# EAGLE design WT32SC01-POE v2 (EAGLE 9.6.2)
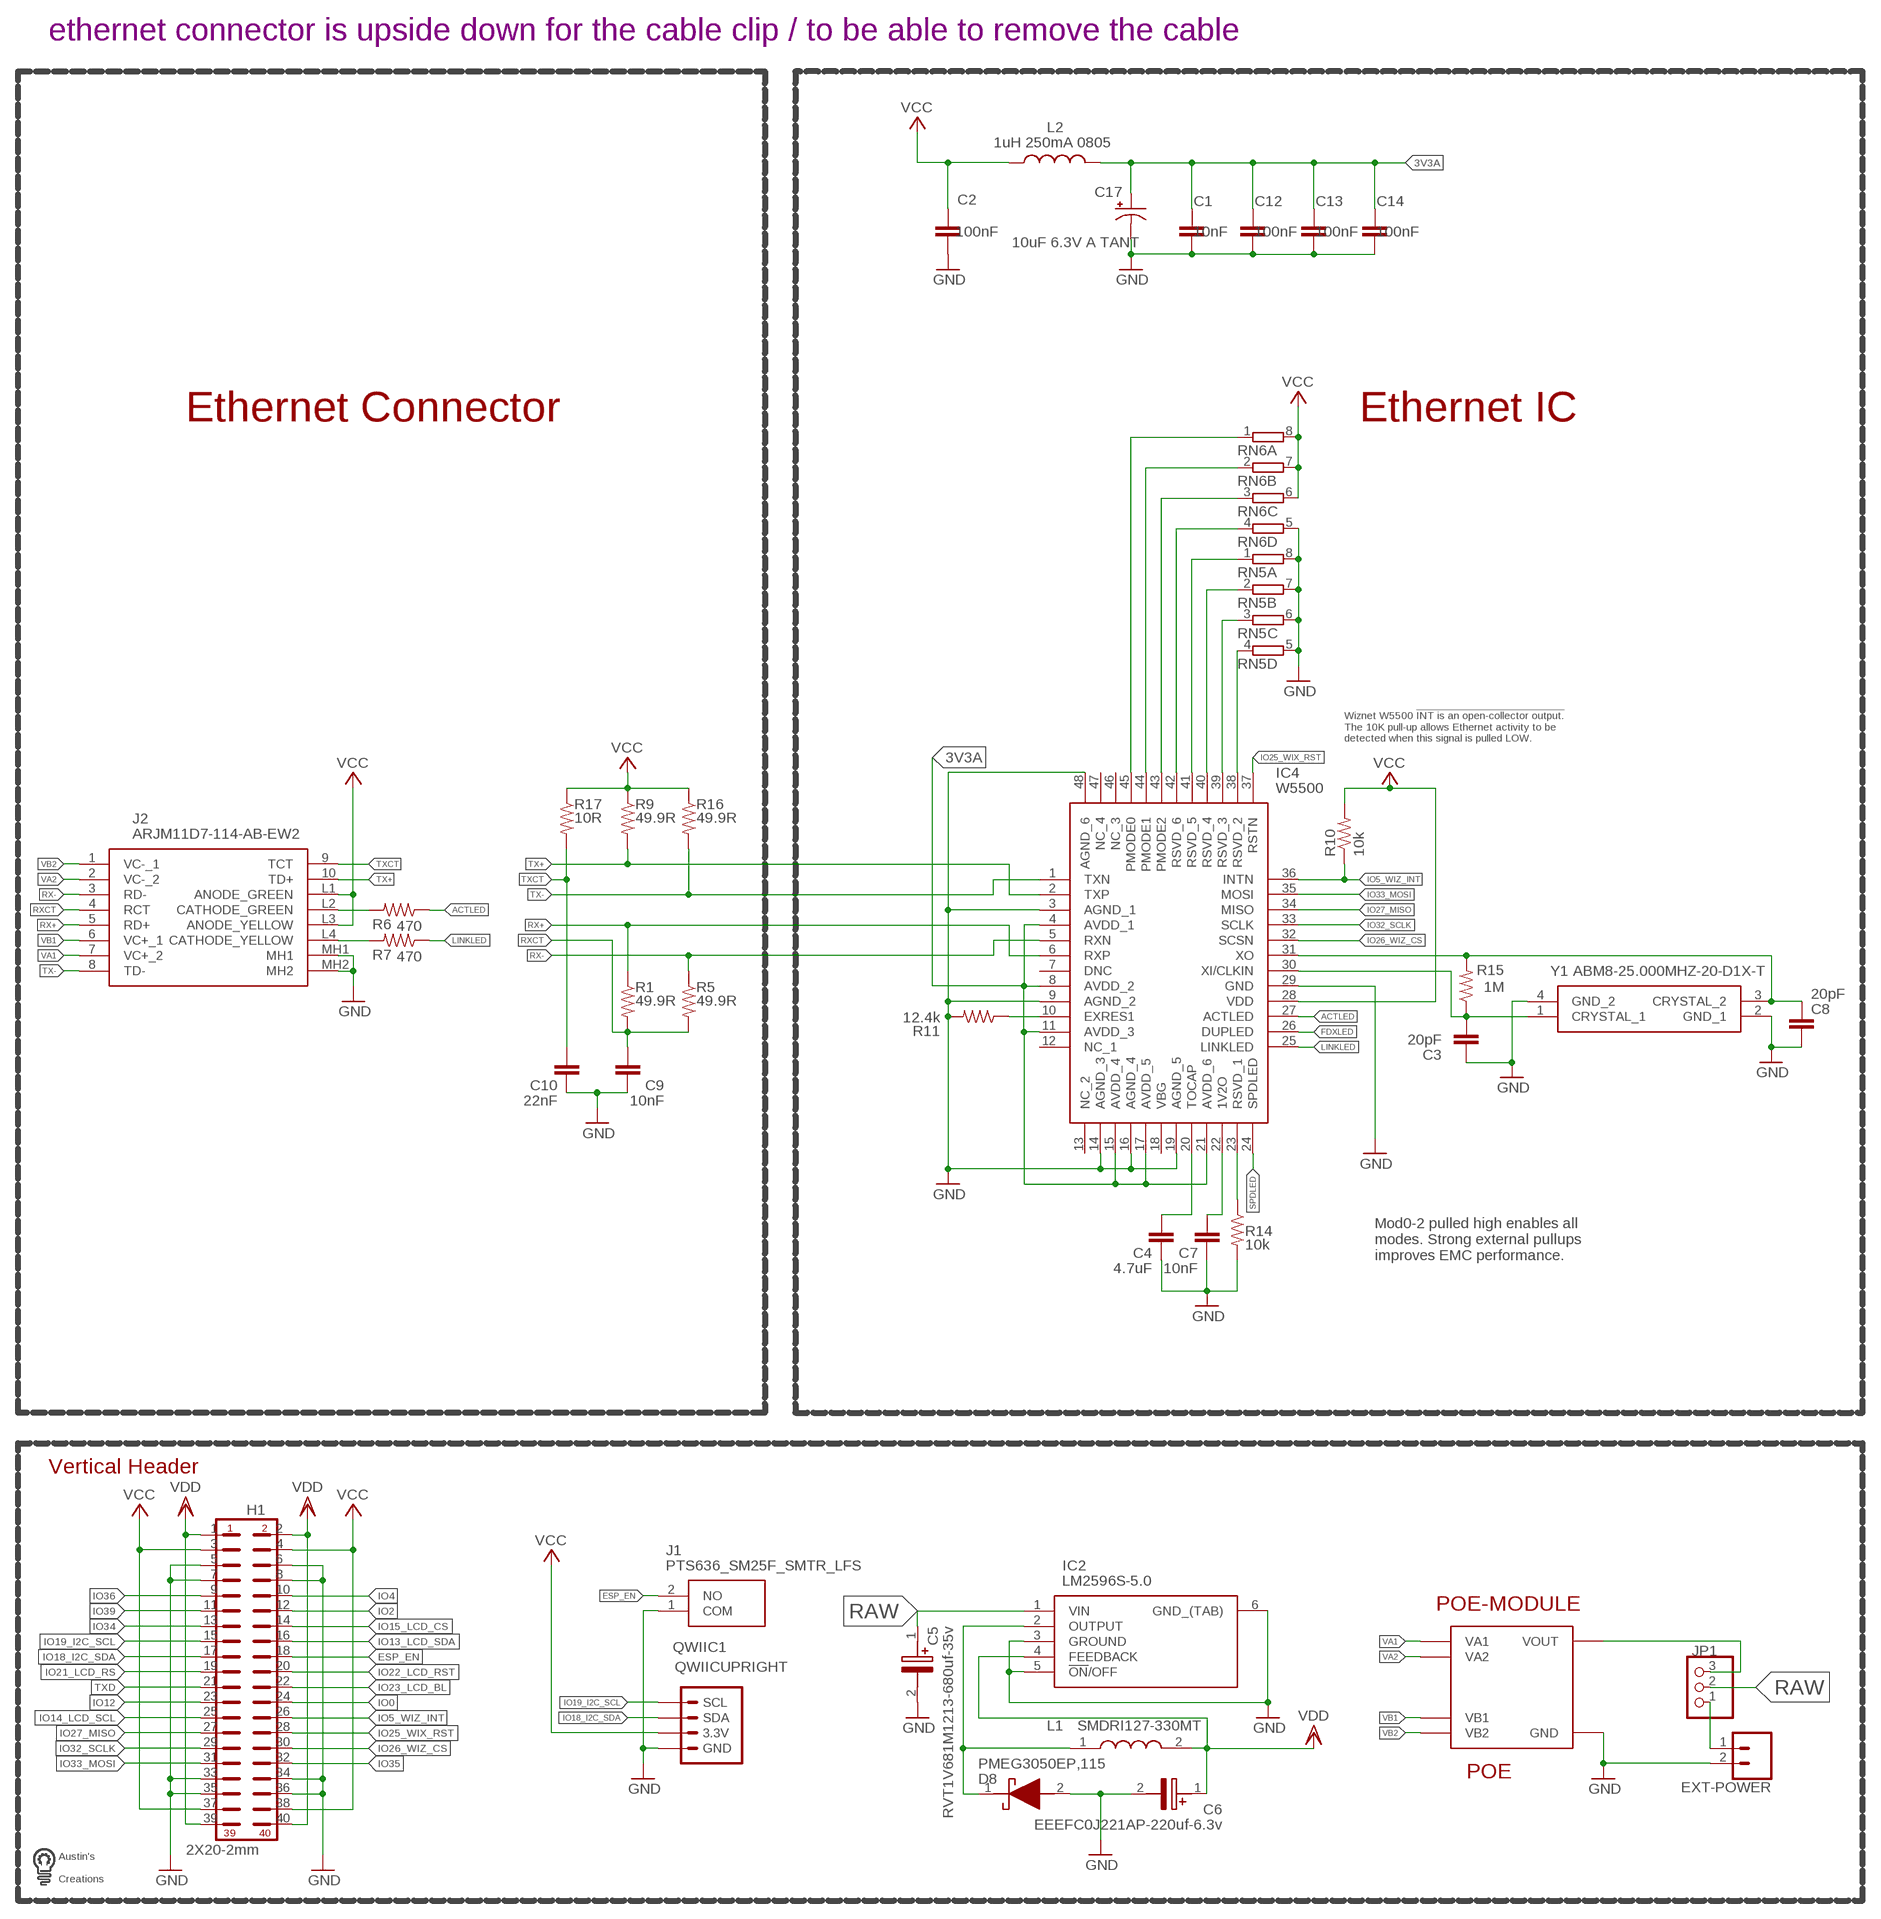
[diagram p0: schematic, sheet 1]

## Parts
C1  10nF  C-EUC0603  [C0603]
C2  100nF  C-EUC0603  [C0603]
C3  20pF  C-EUC0603  [C0603]
C4  4.7uF  C-EUC0603  [C0603]
C5  RVT1V681M1213-680uf-35v  EEE-HD1V681AQ  [CAPAE1350X1400N]
C6  EEEFC0J221AP-220uf-6.3v  EEEFC0J221AP  [CAPAE830X650N]
C7  10nF  C-EUC0603  [C0603]
C8  20pF  C-EUC0603  [C0603]
C9  10nF  C-EUC0603  [C0603]
C10  22nF  C-EUC0603  [C0603]
C12  100nF  C-EUC0603  [C0603]
C13  100nF  C-EUC0603  [C0603]
C14  100nF  C-EUC0603  [C0603]
C17  10uF 6.3V A TANT  CPOL-USA/3216-18W  [A/3216-18W]
D8  PMEG3050EP,115  [PMEG3050EP115]
EXT-POWER  JL301-50002U02  2PINBLOCK  [SCREWTERMINAL-5MM-2]
H1  2X20-2mm  M02X20-2.00-P-BELOW  [2X20-2.00-P-BELOW]
IC2  LM2596S-5.0  LM2596S-3.3_NOPB  [TO170P1435X465-6N]
IC4  W5500  [QFP50P900X900X160-48N]
J1  PTS636_SM25F_SMTR_LFS  [PTS636SM25FSMTRLFS]
J2  ARJM11D7-114-AB-EW2  [ARJM11D7114ABEW2]
JP1  PINHD-1X3  [1X03]
L1  SMDRI127-330MT  CDRH127_LDNP-330MC  [INDPM120120X800N]
L2  1uH 250mA 0805  L-USL2012C  [L2012C]
POE-MODULE  POE  [DP1435]
QWIIC1  QWIICUPRIGHT  [BM04B-SRSS-TB]
R1  49.9R  R-US_R0603  [R0603]
R5  49.9R  R-US_R0603  [R0603]
R6  470  R-US_R0603  [R0603]
R7  470  R-US_R0603  [R0603]
R9  49.9R  R-US_R0603  [R0603]
R10  10k  R-US_R0603  [R0603]
R11  12.4k  R-US_R0603  [R0603]
R14  10k  R-US_R0603  [R0603]
R15  1M  R-US_R0603  [R0603]
R16  49.9R  R-US_R0603  [R0603]
R17  10R  R-US_R0603  [R0603]
RN5  4R-N0603-ARC  [0603-ARC]
RN6  4R-N0603-ARC  [0603-ARC]
U$1  LOGOMED  [LOGOMED]
Y1  ABM8-25.000MHZ-20-D1X-T  [ABM825000MHZ10B1UT]

## Nets
3V3A: C1.1 C12.1 C13.1 C14.1 C17.+ IC4.4(AVDD_1) IC4.8(AVDD_2) IC4.11(AVDD_3) IC4.15(AVDD_4) IC4.17(AVDD_5) IC4.21(AVDD_6) L2.2
ACTLED: IC4.27(ACTLED) R6.1
ESP_EN: H1.18 J1.2(NO)
FDXLED: IC4.26(DUPLED)
GND: C1.2 C2.2 C3.1 C4.1 C5.2(-) C6.2(-) C7.1 C8.1 C9.1 C10.1 C12.2 C13.2 C14.2 C17.- D8.2(A) EXT-POWER.2 H1.5 H1.6 H1.7 H1.8 H1.33 H1.34 H1.35 H1.36 IC2.3(GROUND) IC2.5(!ON!/OFF) IC2.6(GND_(TAB)) IC4.3(AGND_1) IC4.9(AGND_2) IC4.14(AGND_3) IC4.16(AGND_4) IC4.19(AGND_5) IC4.29(GND) IC4.48(AGND_6) J1.1(COM) J2.MH1 J2.MH2 POE-MODULE.GND QWIIC1.1(GND) R11.2 R14.2 RN5.5 RN5.6 RN5.7 RN5.8 RN6.5 Y1.2(GND_1) Y1.4(GND_2)
IO0: H1.24
IO2: H1.12
IO4: H1.10
IO5_WIZ_INT: H1.26 IC4.36(INTN) R10.1
IO12: H1.23
IO13_LCD_SDA: H1.16
IO14_LCD_SCL: H1.25
IO15_LCD_CS: H1.14
IO18_I2C_SDA: H1.17 QWIIC1.3(SDA)
IO19_I2C_SCL: H1.15 QWIIC1.4(SCL)
IO21_LCD_RS: H1.19
IO22_LCD_RST: H1.20
IO23_LCD_BL: H1.22
IO25_WIX_RST: H1.28 IC4.37(RSTN)
IO26_WIZ_CS: H1.30 IC4.32(SCSN)
IO27_MISO: H1.27 IC4.34(MISO)
IO32_SCLK: H1.29 IC4.33(SCLK)
IO33_MOSI: H1.31 IC4.35(MOSI)
IO34: H1.13
IO35: H1.32
IO36: H1.9
IO39: H1.11
LINKLED: IC4.25(LINKLED) R7.1
N$1: EXT-POWER.1 JP1.1
N$2: IC4.10(EXRES1) R11.1
N$3: IC4.23(RSVD_1) R14.1
N$4: IC4.38(RSVD_2) RN5.4
N$5: IC4.39(RSVD_3) RN5.3
N$6: IC4.40(RSVD_4) RN5.2
N$7: IC4.41(RSVD_5) RN5.1
N$9: IC4.42(RSVD_6) RN6.4
N$10: C8.2 IC4.31(XO) R15.2 Y1.3(CRYSTAL_2)
N$11: IC4.43(PMODE2) RN6.3
N$12: IC4.44(PMODE1) RN6.2
N$13: IC4.45(PMODE0) RN6.1
N$16: C3.2 IC4.30(XI/CLKIN) R15.1 Y1.1(CRYSTAL_1)
N$17: JP1.3 POE-MODULE.VOUT
N$19: J2.L2(CATHODE_GREEN) R6.2
N$20: D8.1(K) IC2.2(OUTPUT) L1.1
N$21: J2.L4(CATHODE_YELLOW) R7.2
N$25: C7.2 IC4.22(1V2O)
N$26: C4.2 IC4.20(TOCAP)
RAW: C5.1(+) IC2.1(VIN) JP1.2
RX+: IC4.6(RXP) J2.5(RD+) R1.1
RX-: IC4.5(RXN) J2.3(RD-) R5.1
RXCT: C9.2 J2.4(RCT) R1.2 R5.2
SPDLED: IC4.24(SPDLED)
TX+: IC4.2(TXP) J2.10(TD+) R9.2
TX-: IC4.1(TXN) J2.8(TD-) R16.2
TXCT: C10.2 J2.9(TCT) R17.2
TXD: H1.21
VA1: J2.7(VC+_2) POE-MODULE.VA1
VA2: J2.2(VC-_2) POE-MODULE.VA2
VB1: J2.6(VC+_1) POE-MODULE.VB1
VB2: J2.1(VC-_1) POE-MODULE.VB2
VCC: C2.1 H1.3 H1.4 H1.37 H1.38 IC4.28(VDD) J2.L1(ANODE_GREEN) J2.L3(ANODE_YELLOW) L2.1 QWIIC1.2(3.3V) R9.1 R10.2 R16.1 R17.1 RN6.6 RN6.7 RN6.8
VDD: C6.1(+) H1.1 H1.2 H1.39 H1.40 IC2.4(FEEDBACK) L1.2
Unconnected: IC4.7(DNC) IC4.12(NC_1) IC4.13(NC_2) IC4.18(VBG) IC4.46(NC_3) IC4.47(NC_4)

## Notes on the sheet
- ethernet connector is upside down for the cable clip / to be able to remove the cable
- Ethernet Connector | Ethernet IC
- Wiznet W5500 !INT is an open-collector output.
  The 10K pull-up allows Ethernet activity to be
  detected when this signal is pulled LOW.
- Mod0-2 pulled high enables all
  modes. Strong external pullups
  improves EMC performance.
- Vertical Header

## Library data of the parts
C1 C2 C12-C14 = rcl:C-EU: CAPACITOR, European symbol; SPICEPREFIX: C
C3 C4 C7-C10 = resistor:C-EU: CAPACITOR, European symbol
C5 = SamacSys_Parts:EEE-HD1V681AQ: Aluminium Electrolytic Capacitors - SMD 35VDC 680uF 20% AEC-Q200 Source: Datasheet <https://industrial.panasonic.com/cdbs/www-data/pdf/RDE0000/ABA0000C1166.pdf>; DESCRIPTION: Aluminium Electrolytic Capacitors - SMD 35VDC 680uF 20% AEC-Q200; HEIGHT: 14mm; MANUFACTURER_NAME: Panasonic; MANUFACTURER_PART_NUMBER: EEE-HD1V681AQ; MOUSER_PART_NUMBER: 667-EEE-HD1V681AQ; MOUSER_PRICE-STOCK: https://www.mouser.co.uk/ProductDetail/Panasonic/EEE-HD1V681AQ?qs=w%2Fv1CP2dgqoW7i2Hoqi%252B9w%3D%3D
C6 = SamacSys_Parts:EEEFC0J221AP: PANASONIC - EEEFC0J221AP - SMD Aluminium Electrolytic Capacitor, Radial Can - SMD, 220 F, 6.3 V, EEEFC Series Source: Datasheet <https://industrial.panasonic.com/cdbs/www-data/pdf/RDE0000/ABA0000C1169.pdf>; DESCRIPTION: PANASONIC - EEEFC0J221AP - SMD Aluminium Electrolytic Capacitor, Radial Can - SMD, 220 F, 6.3 V, EEEFC Series; HEIGHT: 6.5mm; MANUFACTURER_NAME: Panasonic; MANUFACTURER_PART_NUMBER: EEEFC0J221AP
C17 = rcl:CPOL-US: POLARIZED CAPACITOR, American symbol; SPICEPREFIX: C
D8 = SamacSys_Parts:PMEG3050EP,115: NXP PMEG3050EP,115 SMT Schottky Diode, 30V 5A, 2-Pin SOD-128 Source: Datasheet <https://docs-emea.rs-online.com/webdocs/14cd/0900766b814cd012.pdf>; ARROW_PART_NUMBER: PMEG3050EP,115; ARROW_PRICE-STOCK: https://www.arrow.com/en/products/pmeg3050ep115/nexperia; DESCRIPTION: NXP PMEG3050EP,115 SMT Schottky Diode, 30V 5A, 2-Pin SOD-128; HEIGHT: 1mm; MANUFACTURER_NAME: Nexperia; MANUFACTURER_PART_NUMBER: PMEG3050EP,115; MOUSER_PART_NUMBER: 771-PMEG3050EP115; MOUSER_PRICE-STOCK: https://www.mouser.co.uk/ProductDetail/Nexperia/PMEG3050EP115?qs=GcY6OjH1zdmnjQ%2FhUT5aOA%3D%3D
EXT-POWER = custom parts:2PINBLOCK
H1 = SuperHouse-Connectors:M02X20: M40 header in 2x20 format
IC2 = SamacSys_Parts:LM2596S-3.3_NOPB: SIMPLE SWITCHER® 4.5V to 40V, 3A Low Component Count Step-Down Regulator Source: Datasheet <http://www.ti.com/lit/ds/symlink/lm2596.pdf>; DESCRIPTION: SIMPLE SWITCHER&#174; 4.5V to 40V, 3A Low Component Count Step-Down Regulator; HEIGHT: 4.65mm; MANUFACTURER_NAME: Texas Instruments; MANUFACTURER_PART_NUMBER: LM2596S-3.3/NOPB; MOUSER_PART_NUMBER: 926-LM2596S-3.3/NOPB; MOUSER_PRICE-STOCK: https://www.mouser.co.uk/ProductDetail/Texas-Instruments/LM2596S-33-NOPB?qs=X1J7HmVL2ZHsEwG9Q6doow%3D%3D
IC4 = SamacSys_Parts:W5500: Ethernet ICs 3in1 Enet Controller TCP/IP +MAC+PHY Source: Datasheet <http://wizwiki.net/wiki/lib/exe/fetch.php?media=products:w5500:w5500_ds_v106e_141230.pdf>; DESCRIPTION: Ethernet ICs 3in1 Enet Controller TCP/IP +MAC+PHY; HEIGHT: 1.6mm; MANUFACTURER_NAME: WIZnet Inc; MANUFACTURER_PART_NUMBER: W5500; MOUSER_PART_NUMBER: 950-W5500; MOUSER_PRICE-STOCK: https://www.mouser.co.uk/ProductDetail/WIZnet/W5500/?qs=2vh%252B45pPFtzthUpYPd4pqA%3D%3D
J1 = SamacSys_Parts:PTS636_SM25F_SMTR_LFS: Tactile Switches Tact 50mA 12VDC, 6.0x3.5, 2.5mm H, 180gf, F leads, No ground pin, White Actuator Source: Datasheet <https://ms.componentsearchengine.com/Datasheets/1/PTS636 SM25F SMTR LFS.pdf>; ARROW_PART_NUMBER: PTS636 SM25F SMTR LFS; ARROW_PRICE-STOCK: https://www.arrow.com/en/products/pts636-sm25f-smtr-lfs/ck; DESCRIPTION: Tactile Switches Tact 50mA 12VDC, 6.0x3.5, 2.5mm H, 180gf, F leads, No ground pin, White Actuator; HEIGHT: 2.7mm; MANUFACTURER_NAME: C & K COMPONENTS; MANUFACTURER_PART_NUMBER: PTS636 SM25F SMTR LFS; MOUSER_PART_NUMBER: 611-PTS636SM25FSMTRL; MOUSER_PRICE-STOCK: https://www.mouser.co.uk/ProductDetail/CK/PTS636-SM25F-SMTR-LFS?qs=vLWxofP3U2wcBTQSwfMFOw%3D%3D
J2 = custom parts:ARJM11D7-114-AB-EW2: Modular Connectors / Ethernet Connectors Source: Datasheet; DESCRIPTION: Modular Connectors / Ethernet Connectors; HEIGHT: 13.6mm; MANUFACTURER_NAME: ABRACON; MANUFACTURER_PART_NUMBER: ARJM11D7-114-AB-EW2; MOUSER_PART_NUMBER: 815-RJM11D7114ABEW2; MOUSER_PRICE-STOCK: https://www.mouser.co.uk/ProductDetail/ABRACON/ARJM11D7-114-AB-EW2?qs=YCa%2FAAYMW02ICsJcHu%252BNJg%3D%3D
JP1 = custom parts:PINHD-1X3: PIN HEADER
L1 = SamacSys_Parts:CDRH127_LDNP-330MC: Fixed Inductors 33uH 3.9A Source: Datasheet <https://products.sumida.com/products/pdf/CDRH127LD.pdf>; DESCRIPTION: Fixed Inductors 33uH 3.9A; HEIGHT: 8mm; MANUFACTURER_NAME: Sumida; MANUFACTURER_PART_NUMBER: CDRH127/LDNP-330MC; MOUSER_PART_NUMBER: 851-CDRH127LDNP330MC; MOUSER_PRICE-STOCK: https://www.mouser.co.uk/ProductDetail/Sumida/CDRH127-LDNP-330MC?qs=rZntyWl5IYHj3wgmnQ0WOg%3D%3D
L2 = rcl:L-US: INDUCTOR, American symbol; SPICEPREFIX: L
POE-MODULE = custom parts:POE; POEMODULE: DP1435
QWIIC1 = custom parts:QWIIC
R1 R5-R7 R9-R11 R14-R17 = resistor:R-US_: RESISTOR, American symbol
RN5 RN6 = custom parts:4R-N: Array Chip Resistor Source: RS Component / Phycomp; OC_FARNELL: unknown; OC_NEWARK: unknown
U$1 = custom parts:LOGOMED
Y1 = custom parts:ABM8-25.000MHZ-20-D1X-T: CRYSTAL 25.0000MHZ 20PF SMD Source: Datasheet <https://abracon.com/Resonators/abm8.pdf>; DESCRIPTION: CRYSTAL 25.0000MHZ 20PF SMD; HEIGHT: 0.8mm; MANUFACTURER_NAME: ABRACON; MANUFACTURER_PART_NUMBER: ABM8-25.000MHz-20-D1X-T; MOUSER_PART_NUMBER: 815-M825000MHZ20D1XT; MOUSER_PRICE-STOCK: https://www.mouser.co.uk/ProductDetail/ABRACON/ABM8-25000MHZ-20-D1X-T?qs=vLWxofP3U2wG9GR0CKrroQ%3D%3D

## Board
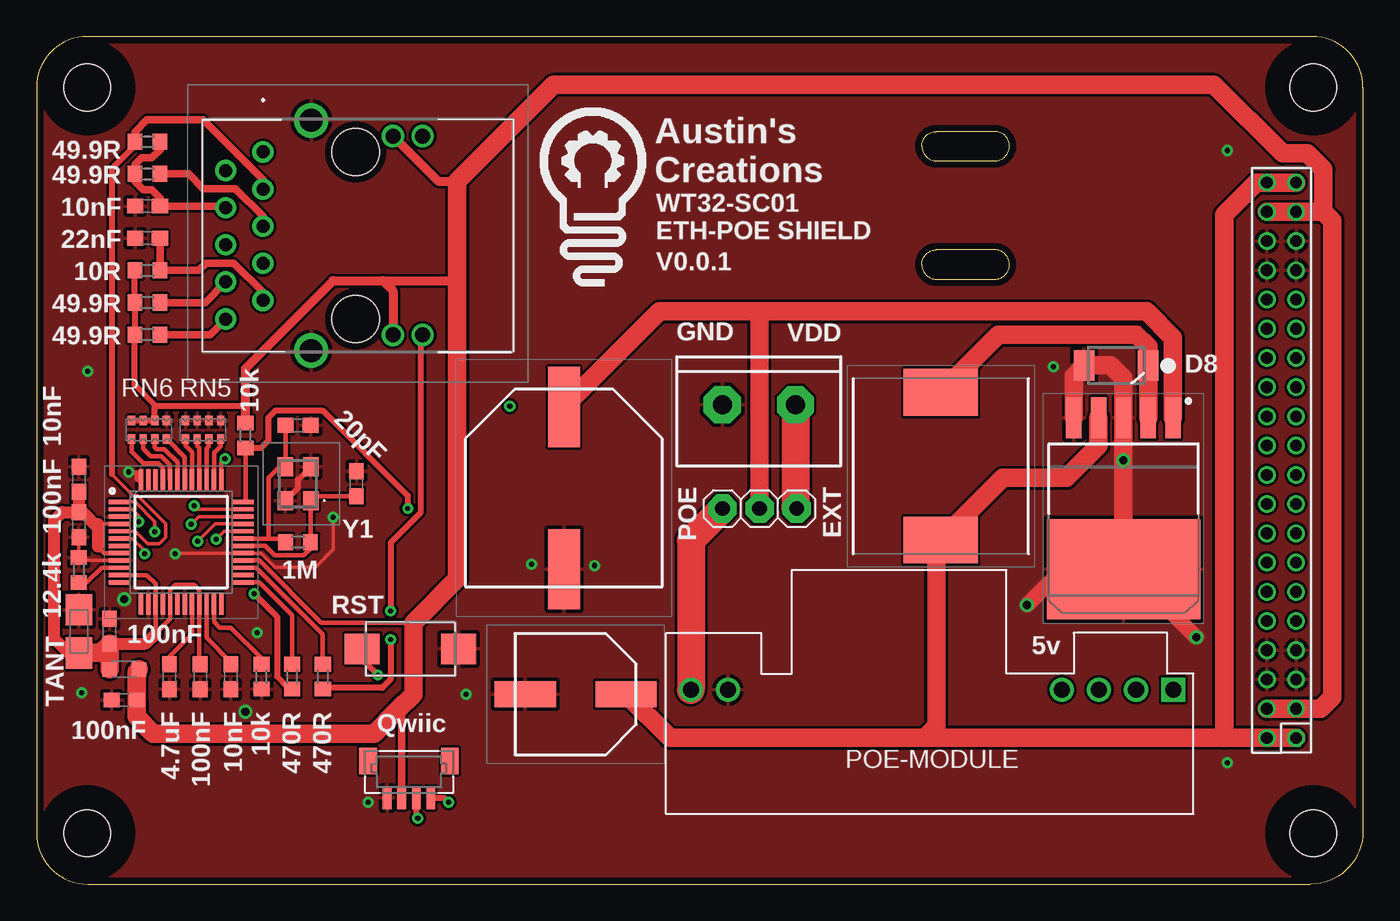
[diagram p1: board, top side]
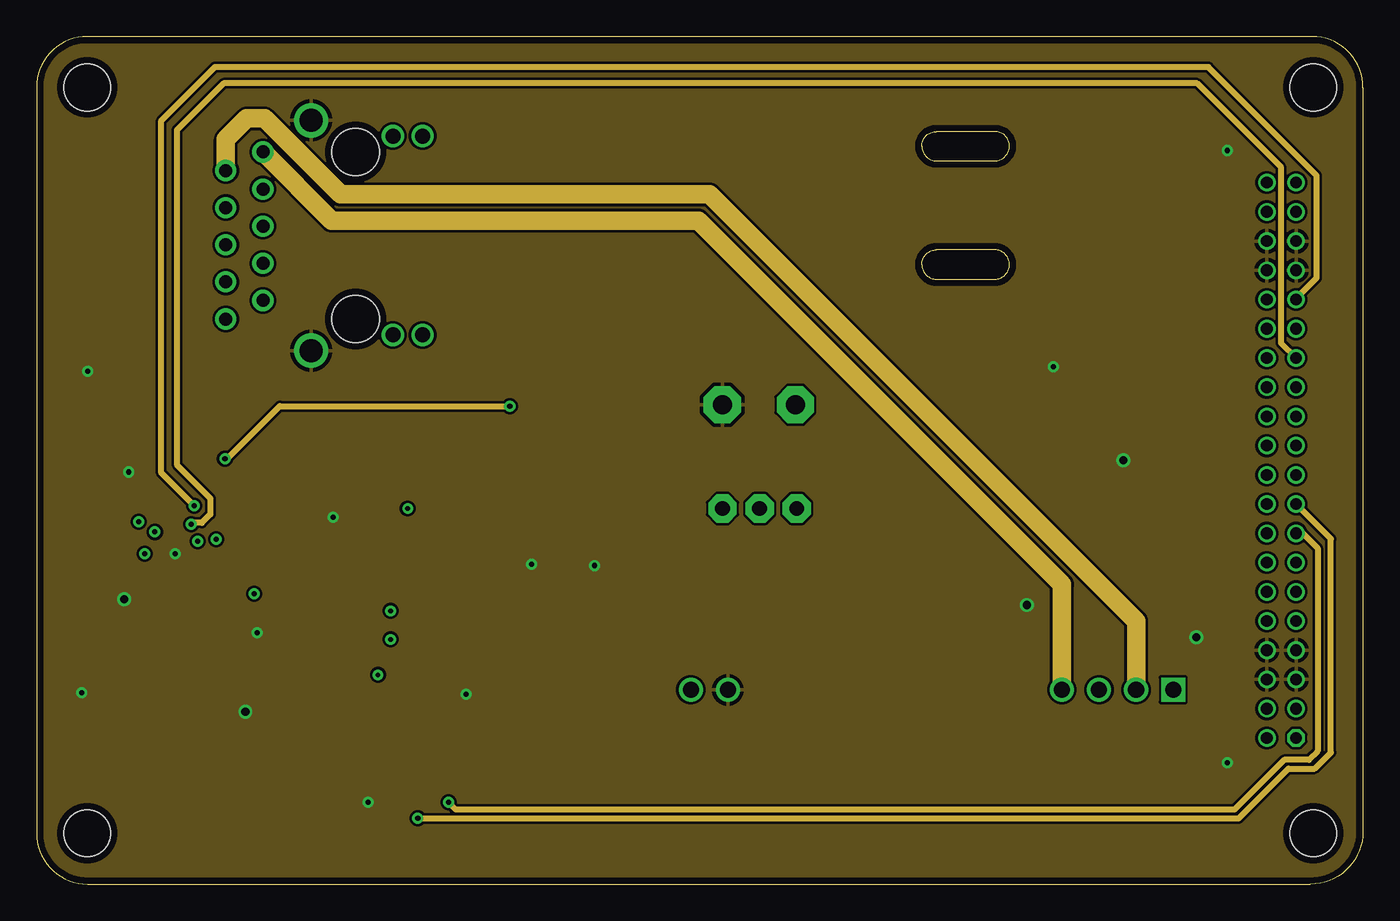
[diagram p2: board, inner layer Route2]
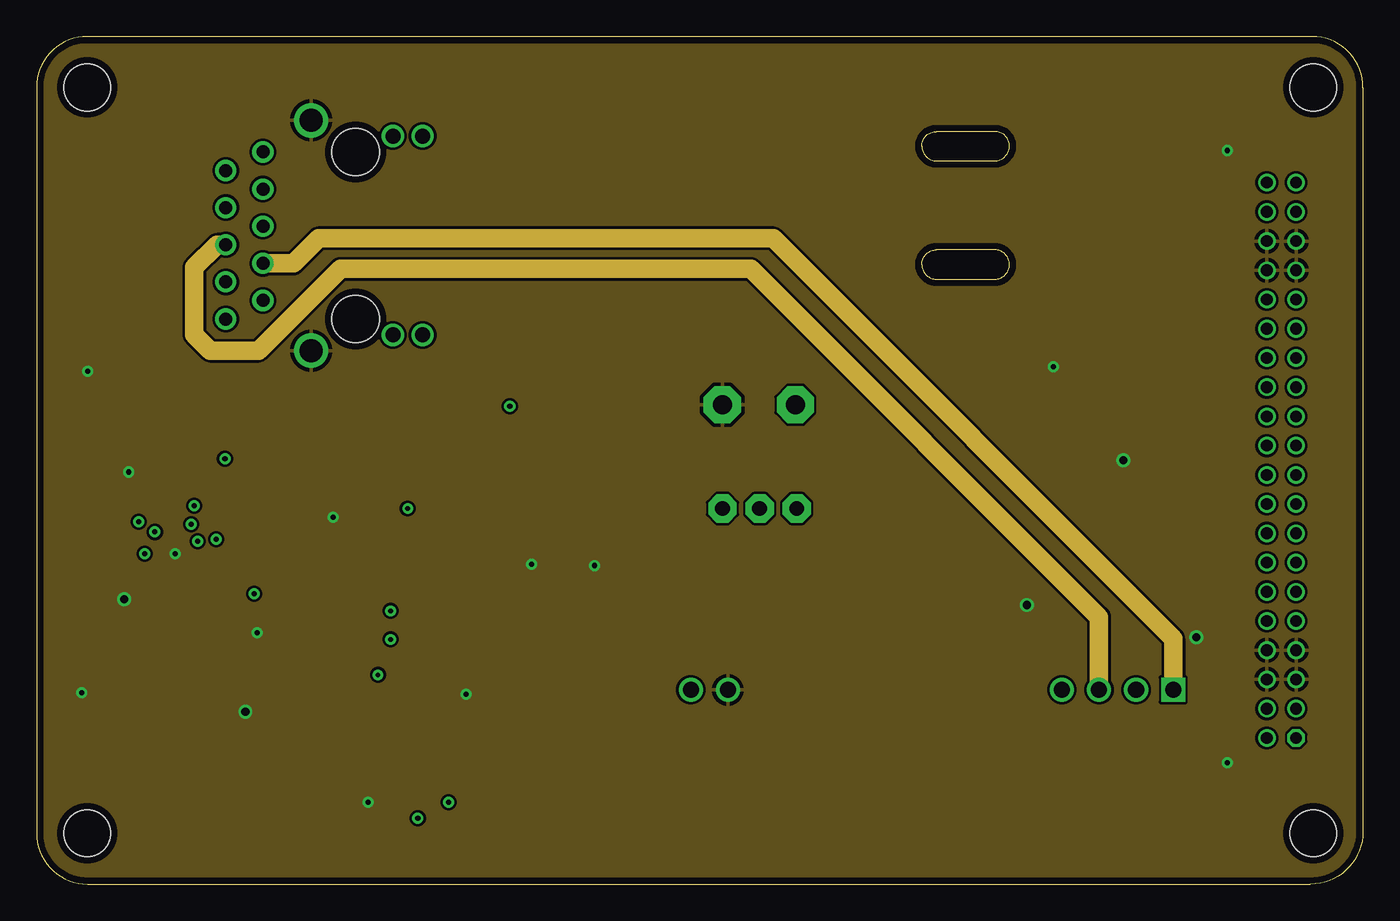
[diagram p3: board, inner layer Route15]
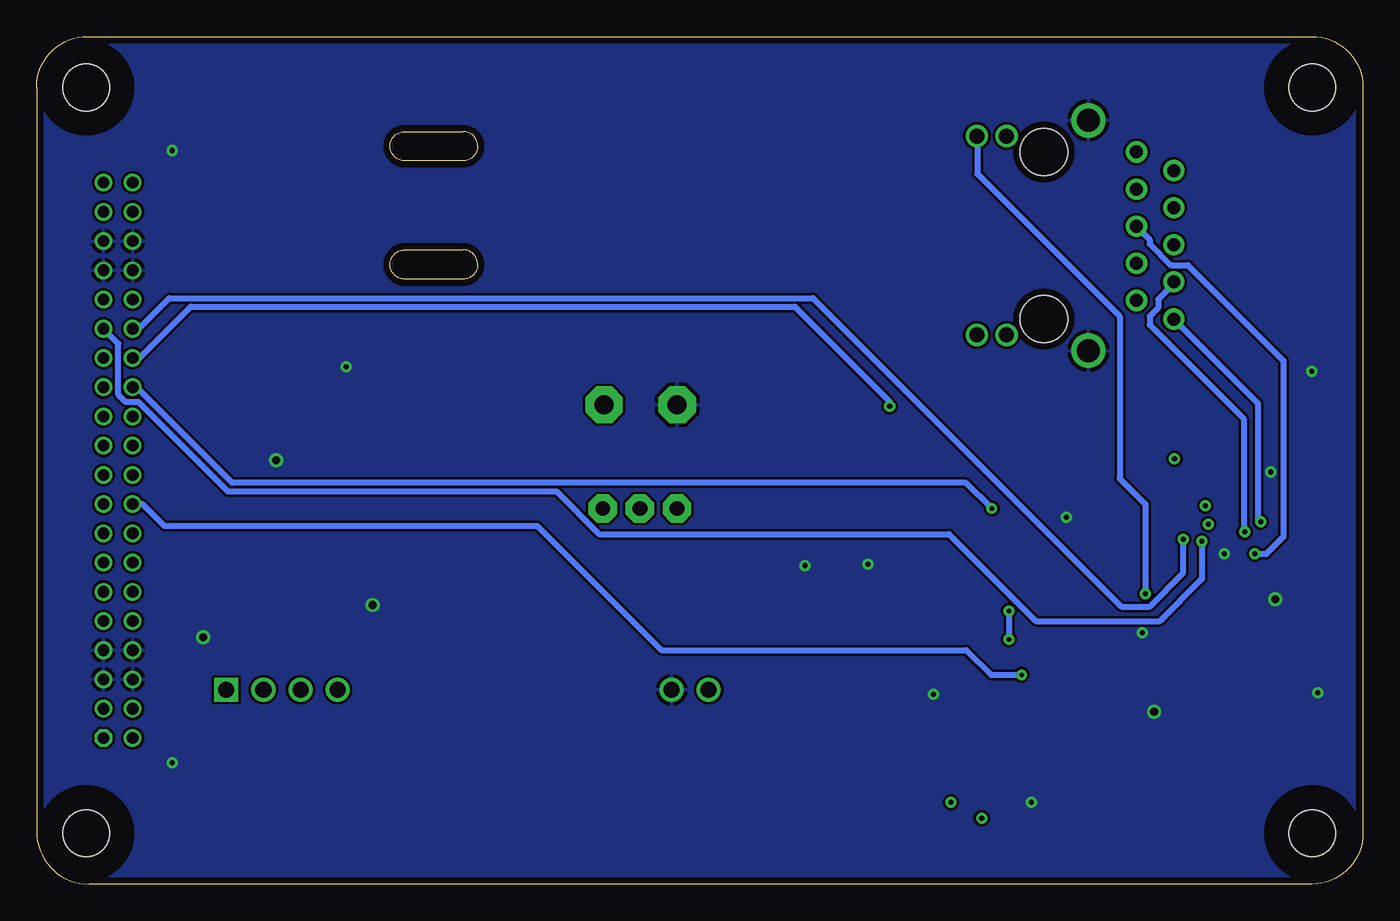
[diagram p4: board, bottom side, seen from below]

Size 90.8 x 58 mm. Coordinates in mm from the lower left corner, seen from the top.
Outline: 87.3,58 3.5,58 arc90 0,54.5 0,3.5 arc90 3.5,0 87.2,0 arc90 90.8,3.6 90.8,54.5 arc90 87.3,58
Outline: 60.6,50.5 arc-90 61.6,51.5 65.6,51.5 arc-90 66.6,50.5 arc-90 65.6,49.5 61.6,49.5 arc-90 60.6,50.5
Outline: 60.6,42.4 arc-90 61.6,43.4 65.6,43.4 arc-90 66.6,42.4 arc-90 65.6,41.4 61.6,41.4 arc-90 60.6,42.4
Copper layers (1+2*15+16): Top 0.035mm / dielectric 1.11mm / Route2 0.035mm / dielectric 0.15mm / Route15 0.035mm / dielectric 0.2mm / Bottom 0.035mm
Design rules "SuperHouse-Design-Rules *": minimum track width 10mil, minimum drill 13mil, track to track 7mil, track to pad 7mil, pad to pad 7mil, via to via 7mil, smd to smd 6mil, copper to edge 18mil, drill to drill 8mil, minimum pad ring 7mil, minimum via ring 8mil, stop-mask expansion 4mil, vias tented up to drill 0.5mm, thermal gap 10mil
Holes 3.2 mm at 3.47,54.52 3.47,3.49 87.4,54.52 87.4,3.49
tRestrict: area 0.3,51.3 to 6.7,57.7; area 0.3,0.3 to 6.7,6.7; area 84.2,0.3 to 90.6,6.7; area 84.2,51.3 to 90.6,57.7
bRestrict: area 0.3,51.3 to 6.7,57.7; area 0.3,0.3 to 6.7,6.7; area 84.2,0.3 to 90.6,6.7; area 84.2,51.3 to 90.6,57.7

### Footprints (pad centres in the part's own frame; a part is rotated, then mirrored left to right if it is on the bottom)
C0603 = smd 1.1 x 1: 1 -0.85,0; 2 0.85,0
CAPAE1350X1400N = smd 5.5 x 2.2: 1 -5.55,0; 2 5.55,0
CAPAE830X650N = smd 4.2 x 1.8: 1 -3.45,0; 2 3.45,0
A/3216-18W = smd 2.15 x 1.8: + 1.475,0; - -1.475,0
PMEG3050EP115 = smd 1.4 x 2.1: 1 -2.2,0; 2 2.2,0
SCREWTERMINAL-5MM-2 = drill 1.3 pad 2.54 octagon: 1 -2.54,0; 2 2.46,0
2X20-2.00-P-BELOW = drill 0.8 octagon: 1 -19,-1 | drill 0.8: 2 -19,1; 3 -17,-1; 4 -17,1; 5 -15,-1; 6 -15,1; 7 -13,-1; 8 -13,1; 9 -11,-1; 10 -11,1; 11 -9,-1; 12 -9,1; 13 -7,-1; 14 -7,1; 15 -5,-1; 16 -5,1; 17 -3,-1; 18 -3,1; 19 -1,-1; 20 -1,1; 21 1,-1; 22 1,1; 23 3,-1; 24 3,1; 25 5,-1; 26 5,1; 27 7,-1; 28 7,1; 29 9,-1; 30 9,1; 31 11,-1; 32 11,1; 33 13,-1; 34 13,1; 35 15,-1; 36 15,1; 37 17,-1; 38 17,1; 39 19,-1; 40 19,1
TO170P1435X465-6N = smd 2.8 x 1.05: 1 -6.2,3.4; 2 -6.2,1.7; 3 -6.2,0; 4 -6.2,-1.7; 5 -6.2,-3.4 | smd 6.85 x 10.5: 6 4.15,0
QFP50P900X900X160-48N = smd 1.475 x 0.3: 1 -4.238,2.75; 2 -4.238,2.25; 3 -4.238,1.75; 4 -4.238,1.25; 5 -4.238,0.75; 6 -4.238,0.25; 7 -4.238,-0.25; 8 -4.238,-0.75; 9 -4.238,-1.25; 10 -4.238,-1.75; 11 -4.238,-2.25; 12 -4.238,-2.75; 25 4.238,-2.75; 26 4.238,-2.25; 27 4.238,-1.75; 28 4.238,-1.25; 29 4.238,-0.75; 30 4.238,-0.25; 31 4.238,0.25; 32 4.238,0.75; 33 4.238,1.25; 34 4.238,1.75; 35 4.238,2.25; 36 4.238,2.75 | smd 0.3 x 1.475: 13 -2.75,-4.238; 14 -2.25,-4.238; 15 -1.75,-4.238; 16 -1.25,-4.238; 17 -0.75,-4.238; 18 -0.25,-4.238; 19 0.25,-4.238; 20 0.75,-4.238; 21 1.25,-4.238; 22 1.75,-4.238; 23 2.25,-4.238; 24 2.75,-4.238; 37 2.75,4.238; 38 2.25,4.238; 39 1.75,4.238; 40 1.25,4.238; 41 0.75,4.238; 42 0.25,4.238; 43 -0.25,4.238; 44 -0.75,4.238; 45 -1.25,4.238; 46 -1.75,4.238; 47 -2.25,4.238; 48 -2.75,4.238
PTS636SM25FSMTRLFS = smd 2.4 x 2.1: 1 -3.3,0; 2 3.3,0
ARJM11D7114ABEW2 = drill 0.89 pad 1.446: 1 0,0; 2 -1.27,2.54; 3 -2.54,0; 4 -3.81,2.54; 5 -5.08,0; 6 -6.35,2.54; 7 -7.62,0; 8 -8.89,2.54; 9 -10.16,0; 10 -11.43,2.54 | drill 1.02 pad 1.53: L1 -12.515,-8.9; L2 -12.515,-10.93; L3 1.085,-8.9; L4 1.085,-10.93 | drill 1.57 pad 2.355: MH1 2.16,-3.3; MH2 -13.59,-3.3 | hole 3.25: 0,-6.35; -11.43,-6.35
1X03 = drill 1.016 pad 1.93 octagon: 1 -2.54,0; 2 0,0; 3 2.54,0
INDPM120120X800N = smd 3.2 x 5.1: 1 -5.05,0; 2 5.05,0
L2012C = smd 1 x 1: 1 -1,0; 2 1,0
DP1435 = drill 1.1: GND 13.97,0; VA2 -13.97,0; VB1 -11.43,0; VB2 -8.89,0; VOUT 16.51,0 | drill 1.1 square: VA1 -16.51,0
BM04B-SRSS-TB = smd 0.6 x 1.55: 1 1.5,0; 2 0.5,0; 3 -0.5,0; 4 -1.5,0 | smd 1.2 x 1.8: M1 2.8,-2.525; M2 -2.8,-2.525
R0603 = smd 1 x 1.1: 1 -0.85,0; 2 0.85,0
0603-ARC = smd 0.5 x 0.65: 1 -1.2,-0.625; 2 -0.4,-0.625; 3 0.4,-0.625; 4 1.2,-0.625; 5 1.2,0.625; 6 0.4,0.625; 7 -0.4,0.625; 8 -1.2,0.625
ABM825000MHZ10B1UT = smd 1.3 x 1.05: 1 -1.15,-0.875; 2 1.15,-0.875; 3 1.15,0.875; 4 -1.15,0.875

### Placement (x,y rotation side)
C1  2.9,27.7 90 top
C2  6,12.6 180 top
C3  21.9,27.4 270 top
C4  9.1,14.2 90 top
C5  36.1,27.1 270 top
C6  36.9,13 180 top
C7  13.3,14.2 90 top
C8  17.9,31.4 180 top
C9  7.6,46.4 0 top
C10  7.6,44.2 0 top
C12  5,17.3 90 top
C13  11.2,14.2 270 top
C14  2.9,24.6 270 top
C17  2.9,17.3 270 top
D8  73.9,35.5 180 top
EXT-POWER  49.4,32.8 180 top
H1  85.22,29 90 top
IC2  74.4,25.7 270 top
IC4  9.9,23.4 0 top
J1  25.6,16.1 180 top
J2  15.5,50.1 90 top
JP1  49.5,25.7 180 top
L1  61.9,28.6 270 top
L2  6,14.7 180 top
POE-MODULE  61.3,13.3 180 top
QWIIC1  25.5,5.9 180 top
R1  7.6,48.6 180 top
R5  7.6,50.8 0 top
R6  19.6,14.2 270 top
R7  17.5,14.2 270 top
R9  7.6,37.6 0 top
R10  14.3,30.7 90 top
R11  2.9,21.5 90 top
R14  15.4,14.2 270 top
R15  17.9,23.4 180 top
R16  7.6,39.8 0 top
R17  7.6,42 0 top
RN5  11.4,31.1 0 top
RN6  7.7,31.1 0 top
U$1  33.8,40.6 0 top
Y1  17.9,27.4 90 top

### Tracks (layer width: path | path; a pad name or v marks a point on that pad's centre or on a via)
3V3A
  Top 0.254: IC4.4 4.2,24.65
  Top 0.305: IC4.11 7.55,21.15 8.15,20.55 IC4.15 8.15,17.15 9.15,18.15 IC4.17 9.15,20.15 9.5,20.5 10.8,20.5 11.15,20.15 IC4.21 11.15,15.1 C13.1 | IC4.8 4.65,22.65 4.2,23.1
  Top 0.813: C17.+ 2.17,15.82 1.2,16.8 1.2,24.9 1.75,25.45 C14.1 | C1.1 C14.1 | C12.1 7.45,16.45 8.15,17.15 | 4.2,24.65 4.2,24.4 | 4.2,24.4 4.2,23.1 | C14.1 3.15,25.45 4.2,24.4
  Top 1.27: L2.2 C12.1 4.38,15.82 C17.+
ACTLED
  Top 0.305: IC4.27 15.05,21.65 19.6,17.1 R6.1
ESP_EN  (via drill 0.33)
  Top 0.406: v23.37,14.31 22.49,15.19 22.49,16.07 J1.2
  Bottom 0.406: v23.37,14.31 25.47,14.31 27.17,16.01 48.02,16.01 56.52,24.51 82.05,24.51 83.54,26 H1.18
GND  (via drill 0.35, 0.55)
  Top 0.254: IC4.9 3.1,22.15 R11.2 C14.2 | v20.3,25.1 20.3,22.9 19.1,21.7 16.33,21.7 15.38,22.65 IC4.29 9.55,22.65 v9.5,22.6
  Top 0.305: IC4.48 6.95,27.64 6.85,27.74 6.85,28.14 6.79,28.2 v6.3,28.2
  Top 0.406: Y1.4 17.9,27.12 17.9,27.68 Y1.2
  Top 1.016: v67.8,19.1 70.25,21.55 IC2.6 74.75,21.55 v79.4,16.9
  Top 1.27: IC2.5 71,34.8 D8.2 73.5,35.5 74.4,34.6 IC2.3 IC2.6
  other vias: 6,19.5 14.3,11.8 74.4,29 29.4,13 33.9,21.9 38.2,21.8 81.5,50.2 69.6,35.4 3.5,35.1 3.1,13.1 15.1,17.2 22.7,5.6 81.5,8.3
  pour Top: 0,0 0,58 90.9,58 90.9,0
  pour Bottom: 0,0 0,58 90.9,58 90.9,0
  pour Route2: 0,0 0,58 90.9,58 90.9,0
  pour Route15: 0,0 90.9,0 90.9,58 0,58
IO5_WIZ_INT  (via drill 0.33)
  Top 0.305: R10.1 14.3,26.31 IC4.36
  Top 0.406: v25.41,25.7 25.41,26.58 19.57,32.42 16.36,32.42 15.88,31.95 15.88,30.36 15.37,29.85 R10.1
  Bottom 0.406: v25.41,25.7 27.16,27.46 77.41,27.46 83.83,33.88 84.12,33.88 H1.26
IO18_I2C_SDA  (via drill 0.35)
  Top 0.406: QWIIC1.3 26,4.6 v26.1,4.5
  Route2 0.406: v26.1,4.5 82.3,4.5 85.7,7.9 87.5,7.9 88.6,9 88.6,23.62 H1.17
IO19_I2C_SCL  (via drill 0.35)
  Top 0.406: QWIIC1.4 27.9,5.9 v28.2,5.6
  Route2 0.406: H1.15 86.69,24 87.7,23 87.7,9.1 87.1,8.5 85.4,8.5 82,5.1 28.7,5.1 v28.2,5.6
IO25_WIX_RST  (via drill 0.35)
  Top 0.305: IC4.37 12.65,28.85 v12.9,29.1
  Route2 0.406: v12.9,29.1 13.14,29.21 16.65,32.72 32.38,32.72 v32.4,32.7
  Bottom 0.406: H1.28 84.12,35.93 83.83,35.93 80.24,39.52 38.88,39.52 32.4,33.03 v32.4,32.7
IO26_WIZ_CS  (via drill 0.35)
  Top 0.254: IC4.32 12.85,24.15 v12.3,23.6
  Bottom 0.406: v12.3,23.6 12.3,21.29 14.61,18.99 16.53,18.99 37.64,40.1 81.7,40.1 83.83,37.97 84.12,37.97 H1.30
IO27_MISO  (via drill 0.35)
  Top 0.254: IC4.34 11.11,25.15 v10.58,24.62
  Route2 0.406: H1.27 85.2,37.02 85.2,49.05 79.45,54.8 12.8,54.8 9.6,51.6 9.6,28.7 11.9,26.4 11.9,25.3 11.32,24.72 10.68,24.72 v10.58,24.62
IO32_SCLK  (via drill 0.35)
  Top 0.254: IC4.33 12.23,24.65 v11.04,23.46
  Bottom 0.406: v11.04,23.46 11.04,23.19 11.02,23.18 11.02,20.89 13.91,18 22.38,18 28.33,23.95 52.29,23.95 55.21,26.87 77.7,26.87 83.81,32.99 84.69,32.99 85.2,33.5 85.2,36.99 H1.29
IO33_MOSI  (via drill 0.35)
  Top 0.254: IC4.35 11.05,25.65 v10.8,25.9
  Route2 0.406: H1.31 86.17,40.02 87.63,41.48 87.63,48.49 80.22,55.9 12.2,55.9 8.5,52.2 8.5,28.2 v10.8,25.9
LINKLED
  Top 0.305: IC4.25 15.25,20.65 17.5,18.4 R7.1
N$1
  Top 1.905: EXT-POWER.1 51.94,25.8 JP1.1
N$2
  Top 0.305: R11.1 3.45,20.65 4.45,21.65 IC4.10
N$3
  Top 0.305: R14.1 15.4,15.45 13.3,17.55 12.55,17.55 12.15,17.95 IC4.23
N$4
  Top 0.305: IC4.38 12.15,29.52 12.6,29.98 RN5.4
N$5
  Top 0.305: RN5.3 11.8,29.98 11.65,29.82 IC4.39
N$6
  Top 0.305: IC4.40 11.15,29.85 11,30 RN5.2
N$7
  Top 0.305: IC4.41 10.65,29.55 10.2,30 RN5.1
N$9
  Top 0.305: RN6.4 10.15,29.23 IC4.42
N$10
  Top 0.305: IC4.31 15.9,23.65 | 15.9,23.65 16.8,23.65 R15.2 | 15.9,23.65 15.9,27.8 16.65,28.55 Y1.3 17.05,28.57 C8.2
N$11
  Top 0.305: RN6.3 8.1,29.9 8.23,29.77 8.74,29.77 9.65,28.86 IC4.43
N$12
  Top 0.305: IC4.44 9.13,27.66 9.13,28.69 8.54,29.28 7.8,29.28 7.3,29.78 RN6.2
N$13
  Top 0.305: RN6.1 6.5,29.6 7.3,28.8 8.34,28.8 8.65,28.49 IC4.45
N$16
  Top 0.305: IC4.30 15.65,23.15 16.3,22.5 18.3,22.5 18.75,22.95 R15.1 18.77,23.43 Y1.1 19.07,26.55 C3.2
N$17
  Top 1.905: JP1.3 44.79,23.53 POE-MODULE.VOUT
N$19  (via drill 0.33)
  Top 0.406: v24.24,16.74 24.24,14.02 23.66,13.44 19.86,13.44 R6.2 | v24.24,18.69 24.24,23.37 26.29,25.41 26.29,37.39 J2.L2
  Bottom 0.406: v24.24,18.69 v24.24,16.74
N$20
  Top 1.27: IC2.2 D8.1 76.1,36.8 75.3,37.6 65.85,37.6 L1.1
N$21  (via drill 0.33)
  Top 0.406: v14.9,19.86 16.46,18.3 16.46,14.21 17.23,13.44 R7.2
  Bottom 0.406: v14.9,19.86 14.9,26 16.65,27.75 16.65,38.85 26.41,48.6 26.41,51.17 J2.L4
N$25
  Top 0.305: IC4.22 11.65,16.85 13.3,15.2 C7.2
N$26
  Top 0.305: C4.2 9.1,15.6 10.65,17.15 IC4.20
RAW
  Top 1.27: IC2.1 77.8,37.4 76,39.2 49.5,39.2 | C5.1 42.65,39.2 49.5,39.2 | JP1.2 49.5,39.2
RX+  (via drill 0.35)
  Top 0.254: IC4.6 6.55,23.65 7.4,22.8 v7.4,22.6
  Top 0.508: R1.1 10.4,48.6 11.4,47.6 13.6,47.6 15.5,45.7 J2.5
  Bottom 0.406: v7.4,22.6 6.61,22.6 5.45,23.76 5.45,35.83 11.98,42.35 13.14,42.35 14.61,43.81 14.61,44.11 15.48,44.98 J2.5
RX-
  Top 0.254: IC4.5 6.75,24.15 7.6,23.3 8.4,23.3 8.85,23.75 8.85,24.66 6.93,26.58 6.62,26.58 5.15,28.05
  Top 0.406: 5.15,28.05 5.15,48.97 6.72,50.53 R5.1
  Top 0.508: J2.3 15.5,48.2 11.4,52.3 7.55,52.3 6.75,51.5 R5.1
RXCT
  Top 0.508: R5.2 8.45,50.25 7.9,49.7 7.2,49.7 6.75,49.25 R1.2 6.75,48.05 7.3,47.5 7.9,47.5 8.45,46.95 C9.2 12.85,46.4 J2.4
TX+  (via drill 0.35)
  Top 0.254: IC4.2 6.55,25.65 7,25.2 v7,24.8
  Top 0.508: R9.2 11.89,37.6 J2.10
  Bottom 0.406: v7,24.8 7.1,24.8 7.19,24.89 7.19,32.89 12.56,38.27 12.56,38.56 12.85,38.85 J2.10
TX-  (via drill 0.35)
  Top 0.254: IC4.1 6.75,26.15 8.1,24.8 v8.1,24.1
  Top 0.508: R16.2 11.55,39.8 J2.8
  Bottom 0.406: v8.1,24.1 8.17,24.17 8.17,31.83 14.61,38.27 14.61,38.85 14.02,39.43 14.02,40.02 12.85,41.19 J2.8
TXCT
  Top 0.508: C10.2 R17.2 11.1,42 11.6,42.5 13.5,42.5 15.5,40.5 J2.9
VA1
  Route15 1.27: J2.7 17.6,42.48 19.3,44.18 50.43,44.18 77.81,16.8 POE-MODULE.VA1
VA2
  Route2 1.27: POE-MODULE.VA2 75.27,18 46.07,47.2 20.8,47.2 15.6,52.4 14.4,52.4 12.96,50.96 J2.2
VB1
  Route15 1.27: J2.6 12.35,43.75 10.8,42.2 10.8,37.6 11.9,36.5 15.2,36.5 20.43,41.73 20.8,42.1 48.9,42.1 72.73,18.27 POE-MODULE.VB1
VB2
  Route2 1.27: J2.1 20.2,45.4 45.3,45.4 70.19,20.51 POE-MODULE.VB2
VCC
  Top 0.305: IC4.28 15.23,22.15 19.48,17.9 25.8,17.9
  Top 0.406: H1.3 86.46,12.27 86.46,12 | 6.72,37.68 6.72,39.73 R16.1 6.72,40.02 6.72,41.77 R17.1 | 6.72,37.68 R9.1 | 14.3,32.72 8.16,32.72 | RN6.8 RN6.7 RN6.6 8.1,32.65 8.16,32.72 | 8.16,32.72 6.72,34.16 6.72,37.68
  Top 0.508: QWIIC1.2 25,11.6 24.7,11.9
  Top 0.61: J2.L3 27.48,48.1 28.8,48.1 | R10.2 14.3,32.72 14.3,35.3 20.3,41.3 23.7,41.3 | 23.7,41.3 24.4,40.6 J2.L1 | 23.7,41.3 28.7,41.3 28.8,41.2
  Top 1.27: H1.38 H1.37 88.09,46.01 | 88.09,46.01 88.7,45.4 88.7,12.8 87.9,12 86.46,12 H1.4 | 88.09,46.01 88.09,48.91 87,50 85.3,50 80.6,54.7 35.4,54.7 28.8,48.1 28.8,41.2 28.8,20.9 25.8,17.9 25.8,13 24.7,11.9 23.1,10.3 8,10.3 6.85,11.45 C2.1 6.85,14.55 L2.1
VDD
  Top 1.27: IC2.4 72.7,30 70.5,27.8 66.15,27.8 L1.2 61.6,23.25 61.6,10.8 60.8,10 | C6.1 43.35,10 60.8,10 | 81.3,10 H1.2 H1.1 | 81.3,10 60.8,10 | 81.3,10 81.3,45.8 83.5,48.01 H1.40 H1.39

### Text on the board
tPlace: 49.9R | 49.9R | Austin's / Creations | 10nF | 22nF | WT32-SC01 / ETH-POE SHIELD | 10R | V0.0.1 | 49.9R | 49.9R | VDD | GND | D8 | 10nF | 10k | 20pF | 100nF | POE | EXT | Y1 | 12.4k | 1M | RST | TANT | 5v | 100nF | 4.7uF | 100nF | 10nF | 10k | 470R | 470R | 100nF | Qwiic